# EAGLE design buffmult-rev2 (EAGLE 7.7.0)
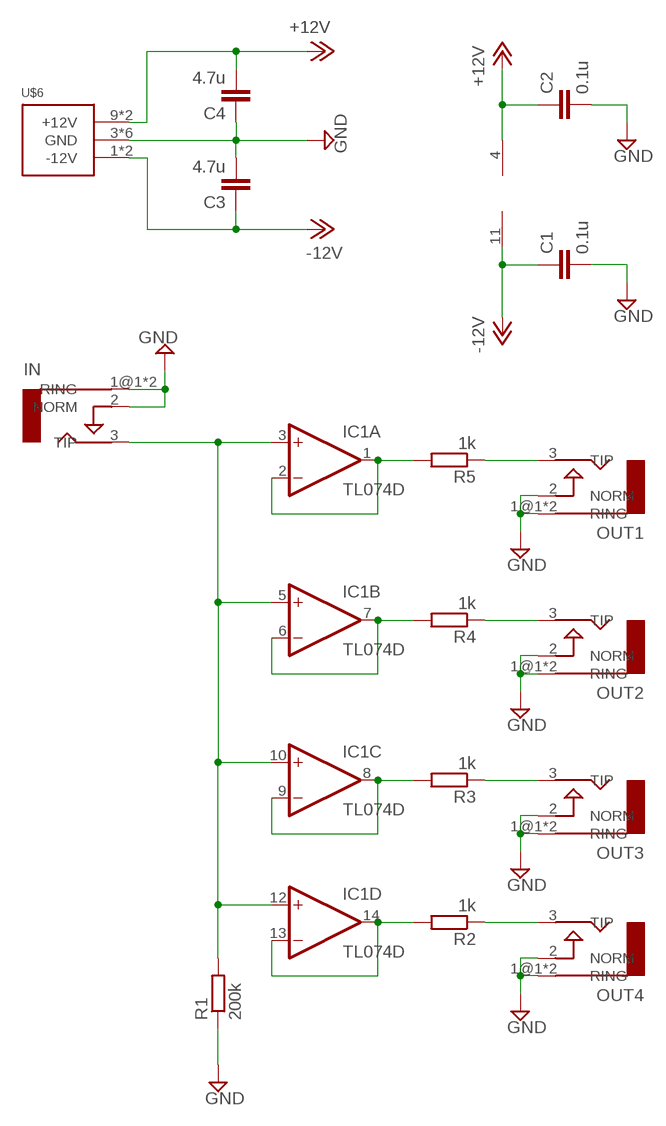
[diagram p0: schematic, sheet 1]

## Parts
C1  0.1u  C-EUC0805  [C0805]
C2  0.1u  C-EUC0805  [C0805]
C3  4.7u  C-EUC0805  [C0805]
C4  4.7u  C-EUC0805  [C0805]
IC1  TL074D  [SO14]
IN  AUDIO-JACKERTHENVAR  [ERTHENVAR-JACK]
OUT1  AUDIO-JACKERTHENVAR  [ERTHENVAR-JACK]
OUT2  AUDIO-JACKERTHENVAR  [ERTHENVAR-JACK]
OUT3  AUDIO-JACKERTHENVAR  [ERTHENVAR-JACK]
OUT4  AUDIO-JACKERTHENVAR  [ERTHENVAR-JACK]
R1  200k  R-EU_R0805  [R0805]
R2  1k  R-EU_R0805  [R0805]
R3  1k  R-EU_R0805  [R0805]
R4  1k  R-EU_R0805  [R0805]
R5  1k  R-EU_R0805  [R0805]
U$6  POWER_SIMPLE10  [POWER_10]

## Nets
+12V: C2.1 C4.2 IC1.4(P:V+) U$6.9(+12V) U$6.10(+12V)
-12V: C1.1 C3.1 IC1.11(P:V-) U$6.1(-12V) U$6.2(-12V)
GND: C1.2 C2.2 C3.2 C4.1 IN.1@1(RING) IN.1@2(RING) IN.2(NORM) OUT1.1@1(RING) OUT1.1@2(RING) OUT1.2(NORM) OUT2.1@1(RING) OUT2.1@2(RING) OUT2.2(NORM) OUT3.1@1(RING) OUT3.1@2(RING) OUT3.2(NORM) OUT4.1@1(RING) OUT4.1@2(RING) OUT4.2(NORM) R1.1 U$6.3(GND) U$6.4(GND) U$6.5(GND) U$6.6(GND) U$6.7(GND) U$6.8(GND)
N$1: IC1.1(A:OUT) IC1.2(A:-IN) R5.2
N$2: IC1.6(B:-IN) IC1.7(B:OUT) R4.2
N$3: IC1.8(C:OUT) IC1.9(C:-IN) R3.2
N$4: IC1.13(D:-IN) IC1.14(D:OUT) R2.2
N$7: IC1.3(A:+IN) IC1.5(B:+IN) IC1.10(C:+IN) IC1.12(D:+IN) IN.3(TIP) R1.2
N$10: OUT4.3(TIP) R2.1
N$11: OUT3.3(TIP) R3.1
N$12: OUT2.3(TIP) R4.1
N$13: OUT1.3(TIP) R5.1

## Library data of the parts
C1-C4 = rcl:C-EU: CAPACITOR, European symbol
IC1 = linear:TL074: OP AMP
IN OUT1-OUT4 = erthenvar:AUDIO-JACK: Switching Mono 3.5mm Audio Jack from Erthenvar.
R1-R5 = rcl:R-EU_: RESISTOR, European symbol
U$6 = eurorack:POWER_SIMPLE

## Board
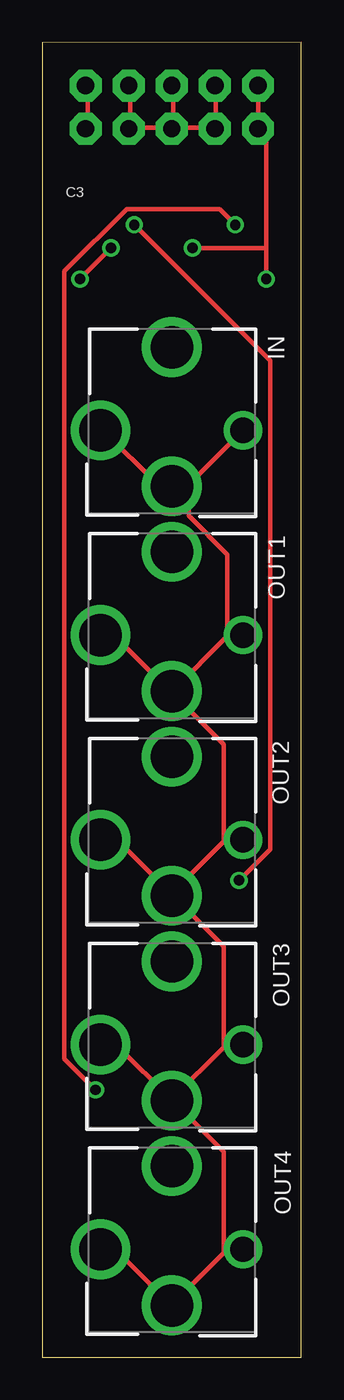
[diagram p1: board, top side]
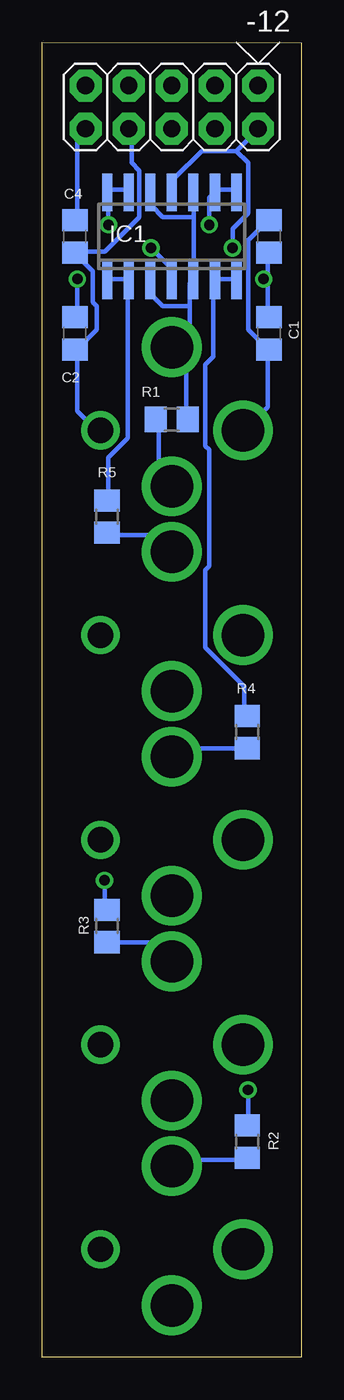
[diagram p2: board, bottom side, seen from below]

Size 15.24 x 77.47 mm. Coordinates in mm from the lower left corner, seen from the top.
Outline: 0,0 15.24,0 15.24,77.47 0,77.46 0,0
Copper layers (1*16): Top 0.035mm / dielectric 1.5mm / Bottom 0.035mm
Design rules "default": minimum track width 10mil, minimum drill 24mil, track to track 8mil, track to pad 8mil, pad to pad 8mil, via to via 8mil, smd to smd 8mil, copper to edge 40mil, drill to drill 8mil, minimum pad ring 10mil, minimum via ring 8mil, stop-mask expansion 4mil, vias tented up to drill 0mil, thermal gap 10mil

### Footprints (pad centres in the part's own frame; a part is rotated, then mirrored left to right if it is on the bottom)
C0805 = smd 1.3 x 1.5: 1 -0.95,0; 2 0.95,0
SO14 = smd 0.6 x 2.2: 1 -3.81,-2.6; 2 -2.54,-2.6; 3 -1.27,-2.6; 4 0,-2.6; 5 1.27,-2.6; 6 2.54,-2.6; 7 3.81,-2.6; 8 3.81,2.6; 9 2.54,2.6; 10 1.27,2.6; 11 0,2.6; 12 -1.27,2.6; 13 -2.54,2.6; 14 -3.81,2.6
ERTHENVAR-JACK = drill 2.5: 1@1 -4.2,0; 2 0,-3.3; 3 0,4.9 | drill 1.5: 1@2 4.2,0
R0805 = smd 1.3 x 1.5: 1 -0.95,0; 2 0.95,0
POWER_10 = drill 1.016 pad 1.88 octagon: 1 -5.08,-1.27; 2 -5.08,1.27; 3 -2.54,-1.27; 4 -2.54,1.27; 5 0,-1.27; 6 0,1.27; 7 2.54,-1.27; 8 2.54,1.27; 9 5.08,-1.27; 10 5.08,1.27

### Placement (x,y rotation side)
C1  1.91,60.33 270 bottom
C2  13.34,60.33 270 bottom
C3  1.91,66.04 90 bottom
C4  13.34,66.04 90 bottom
IC1  7.62,66.04 0 bottom
IN  7.62,54.61 0 top
OUT1  7.62,42.55 0 top
OUT2  7.62,30.48 0 top
OUT3  7.62,18.41 0 top
OUT4  7.62,6.35 0 top
R1  7.62,55.24 0 bottom
R2  3.17,12.7 90 bottom
R3  11.43,25.4 90 bottom
R4  3.17,36.83 90 bottom
R5  11.43,49.53 90 bottom
U$6  7.62,73.66 180 bottom

### Tracks (layer width: path | path; a pad name or v marks a point on that pad's centre or on a via)
+12V  (via drill 0.61)
  Top 0.254: 13.18,65.35 13.18,71.75 12.73,72.21 U$6.10 12.73,72.44 12.73,74.73 U$6.9 | 13.18,65.35 v13.18,63.52 | 13.18,65.35 v8.84,65.35
  Bottom 0.254: v13.18,63.52 13.18,61.47 C2.1 | C4.2 13.18,67.18 13.18,71.75 12.73,72.21 U$6.10 | v8.84,65.35 7.7,64.21 7.7,63.52 IC1.4
-12V  (via drill 0.61)
  Top 0.254: v4.04,65.35 v2.21,63.52 | U$6.1 2.67,74.73 2.67,72.44 U$6.2
  Bottom 0.254: 1.98,63.52 1.98,64.9 C3.1 | 1.98,63.52 1.98,61.47 C1.1 | 3.81,71.07 5.87,71.07 7.47,69.47 7.47,68.78 IC1.11 | 3.81,71.07 2.67,72.21 U$6.2 | v2.21,63.52 1.98,63.52 | v4.04,65.35 4.04,66.5 3.12,67.41 3.12,70.38 3.81,71.07
GND
  Top 0.254: IN.2 7.47,51.41 6.78,51.41 3.58,54.61 IN.1@1 | U$6.7 10.21,74.73 10.21,72.44 U$6.8 9.98,72.44 7.7,72.44 | 5.18,72.44 5.18,74.73 U$6.3 | 7.7,72.44 7.7,74.73 U$6.5 | 5.18,72.44 7.47,72.44 U$6.6 7.7,72.44 | 5.18,72.44 U$6.4 | 8.61,51.41 7.7,51.41 IN.2 | 8.61,51.41 11.81,54.61 IN.1@2 | 10.67,6.15 11.81,6.15 OUT4.1@2 | 10.67,6.15 7.7,3.17 OUT4.2 7.47,3.17 4.5,6.15 3.58,6.15 OUT4.1@1 | 10.67,18.26 11.81,18.26 OUT3.1@2 | 10.67,18.26 7.7,15.29 OUT3.2 | OUT3.1@1 3.58,18.26 4.5,18.26 7.47,15.29 OUT3.2 | 10.67,6.15 10.67,12.09 7.7,15.06 OUT3.2 | 10.67,30.38 11.81,30.38 OUT2.1@2 | 10.67,30.38 7.7,27.41 OUT2.2 | OUT2.1@1 3.58,30.38 4.5,30.38 7.47,27.41 OUT2.2 | 10.9,42.49 11.81,42.49 OUT1.1@2 10.9,42.49 | 10.9,42.49 7.7,39.29 OUT1.2 | OUT1.1@1 3.58,42.49 4.27,42.49 7.47,39.29 OUT1.2 | 10.67,30.38 10.67,36.09 7.7,39.06 OUT1.2 | 10.67,18.26 10.67,24.21 7.7,27.18 OUT2.2 | 8.61,51.41 8.61,49.58 10.9,47.3 10.9,42.49 | 8.61,51.41 IN.2
  Bottom 0.254: R1.1 8.38,55.07 8.38,52.09 7.7,51.41 IN.2 | IN.1@1 3.35,54.61 1.98,55.98 1.98,59.18 C1.2 1.98,59.41 3.12,60.55 3.12,65.81 1.98,66.95 C3.2 | IN.1@2 12.04,54.61 13.18,55.75 13.18,59.18 C2.2 13.18,59.41 12.04,60.55 12.04,61.93 12.27,62.15 12.27,63.98 13.18,64.9 C4.1 13.18,65.13 11.58,65.13 9.53,67.18 9.53,69.93 9.98,70.38 9.98,72.21 U$6.8
N$1
  Bottom 0.254: R5.2 11.35,50.49 11.35,53.01 10.21,54.15 10.21,63.3 IC1.2 10.21,63.52 11.35,63.52 IC1.1
N$2
  Bottom 0.254: R4.2 3.35,37.92 3.35,39.52 5.64,41.81 5.64,46.38 5.41,46.61 5.41,53.47 5.64,53.7 5.64,58.5 5.18,58.95 5.18,63.3 IC1.6 4.95,63.52 3.81,63.52 IC1.7
N$3  (via drill 0.61)
  Top 0.254: v11.58,28.09 13.41,29.92 13.41,58.73 v5.41,66.73
  Bottom 0.254: v11.58,28.09 11.58,26.49 R3.2 | v5.41,66.73 5.41,68.33 5.18,68.55 IC1.9 4.95,68.78 3.81,68.78 IC1.8
N$4  (via drill 0.61)
  Top 0.254: v3.12,15.75 1.3,17.58 1.3,63.98 4.95,67.64 10.44,67.64 v11.35,66.73
  Bottom 0.254: v3.12,15.75 3.12,13.69 R2.2 | v11.35,66.73 11.35,68.55 IC1.14 11.35,68.78 10.21,68.78 IC1.13
N$7
  Bottom 0.254: R1.2 6.78,55.3 6.78,58.73 7.47,59.41 IN.3 7.47,59.64 6.55,60.55 6.55,61.93 | 6.55,61.93 6.55,63.3 IC1.5 6.33,63.52 6.33,67.18 | 6.33,67.18 6.33,68.55 IC1.10 | 6.55,61.93 8.15,61.93 8.84,62.61 8.84,63.3 IC1.3 | 6.33,67.18 8.15,67.18 8.84,67.87 8.84,68.55 IC1.12
N$10
  Bottom 0.254: R2.1 3.35,11.63 7.24,11.63 7.47,11.41 OUT4.3
N$11
  Bottom 0.254: R3.1 11.35,24.44 8.61,24.44 7.7,23.52 OUT3.3
N$12
  Bottom 0.254: R4.1 3.35,35.87 7.01,35.87 7.47,35.41 OUT2.3
N$13
  Bottom 0.254: R5.1 11.35,48.44 8.61,48.44 7.7,47.52 OUT1.3